# Altium schematic sheet 02_Power_Transform_220_24V.SchDoc: Power transform 220VAC to 24VDC
size A4; SheetNumber: 3; SheetTotal: 4
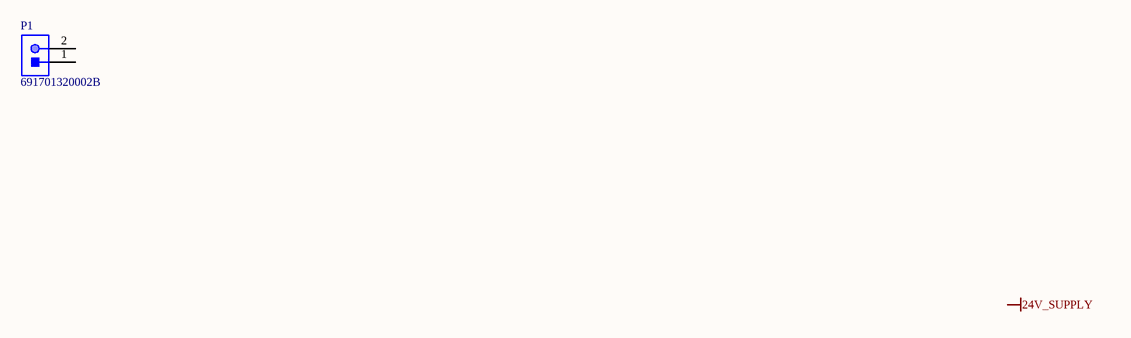
[diagram p0: 02_Power_Transform_220_24V.SchDoc]

## Parts
P1  691701320002B  [691701320002B]

## Nets

Not connected (* = marked no-connect by the designer): P1 1 2

## Notes on the sheet
- Labels drawn without touching a wire or pin: 24V_SUPPLY
- APPROVALS
- DATE
- PROJECT
- BOM:
- REFERENCE DOCUMENTS
- TITLE
- PROJECT REVISION
- DOCUMENT REVISION
- ASSY DWG:
- FAB DWG:
- PCB DWG:
- SIZE:
- Drawn by:
- A4
- FILE NAME:
- Checked by:
- Date:
- REV
- SHEET
- Time:
- OF

## Library data of the parts
P1 = 691701320002B: WR-TBL Serie 7013 Vertical PCB Header THR Type with Flanges, Pluggable, pitch 3.81mm, 2p; Compliance: RoHS; Modularity: No; Pin Number: 2; Rated Current [UL]: 10A; Working Voltage [UL]: 300VAC; ComponentLink1Description: Manufacturer; ComponentLink1URL: http://www.we-online.de; ComponentLink2URL: https://katalog.we-online.de/em/datasheet/691701320002B.pdf; ComponentLink2Description: Datasheet; Mounting Technology: THR; Part Number: 691701320002B; Packaging: Box; Operating Temperature: -40 to +105degC; PCB/Cable/Panel: PCB; Pitch: 3.81mm; Published Date: October 2019; Type: Vertical; Publisher: Wurth Elektronik; Application: Pluggable